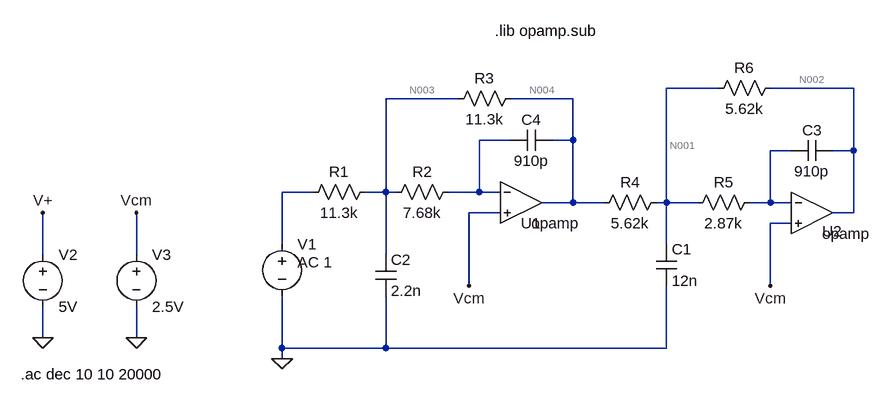
[diagram p0: schematic Anti-Aliasing Filter.asc]
Anti-Aliasing Filter.asc, the LTspice schematic file:
Version 4
SHEET 1 1240 680
WIRE 576 64 496 64
WIRE 784 64 656 64
WIRE 176 80 64 80
WIRE 352 80 256 80
WIRE 256 144 208 144
WIRE 352 144 352 80
WIRE 352 144 320 144
WIRE 688 160 656 160
WIRE 784 160 784 64
WIRE 784 160 752 160
WIRE -48 224 -96 224
WIRE 64 224 64 80
WIRE 64 224 32 224
WIRE 80 224 64 224
WIRE 208 224 208 144
WIRE 208 224 160 224
WIRE 240 224 208 224
WIRE 352 240 352 144
WIRE 352 240 304 240
WIRE 400 240 352 240
WIRE 496 240 496 64
WIRE 496 240 480 240
WIRE 544 240 496 240
WIRE 656 240 656 160
WIRE 656 240 624 240
WIRE 688 240 656 240
WIRE 240 256 192 256
WIRE 784 256 784 160
WIRE 784 256 752 256
WIRE 688 272 656 272
WIRE -96 304 -96 224
WIRE 496 304 496 240
WIRE -464 320 -464 256
WIRE -320 320 -320 256
WIRE 64 320 64 224
WIRE 192 368 192 256
WIRE 656 368 656 272
WIRE -464 448 -464 400
WIRE -320 448 -320 400
WIRE -96 464 -96 384
WIRE 64 464 64 384
WIRE 64 464 -96 464
WIRE 496 464 496 368
WIRE 496 464 64 464
WIRE -96 480 -96 464
FLAG -96 480 0
FLAG -464 448 0
FLAG -320 448 0
FLAG -464 256 V+
FLAG -320 256 Vcm
FLAG 192 368 Vcm
FLAG 656 368 Vcm
SYMBOL Opamps\\opamp 272 176 R0
WINDOW 0 0 96 Left 2
SYMATTR InstName U1
SYMBOL Opamps\\opamp 720 192 R0
WINDOW 0 16 92 Left 2
SYMATTR InstName U2
SYMBOL res 48 208 R90
WINDOW 0 0 56 VBottom 2
WINDOW 3 32 56 VTop 2
SYMATTR InstName R1
SYMATTR Value 11.3k
SYMBOL res 176 208 R90
WINDOW 0 0 56 VBottom 2
WINDOW 3 32 56 VTop 2
SYMATTR InstName R2
SYMATTR Value 7.68k
SYMBOL res 272 64 R90
WINDOW 0 0 56 VBottom 2
WINDOW 3 32 56 VTop 2
SYMATTR InstName R3
SYMATTR Value 11.3k
SYMBOL res 496 224 R90
WINDOW 0 0 56 VBottom 2
WINDOW 3 32 56 VTop 2
SYMATTR InstName R4
SYMATTR Value 5.62k
SYMBOL res 640 224 R90
WINDOW 0 0 56 VBottom 2
WINDOW 3 32 56 VTop 2
SYMATTR InstName R5
SYMATTR Value 2.87k
SYMBOL res 672 48 R90
WINDOW 0 0 56 VBottom 2
WINDOW 3 32 56 VTop 2
SYMATTR InstName R6
SYMATTR Value 5.62k
SYMBOL cap 480 304 R0
SYMATTR InstName C1
SYMATTR Value 12n
SYMBOL cap 48 320 R0
SYMATTR InstName C2
SYMATTR Value 2.2n
SYMBOL cap 752 144 R90
WINDOW 0 0 32 VBottom 2
WINDOW 3 32 32 VTop 2
SYMATTR InstName C3
SYMATTR Value 910p
SYMBOL cap 320 128 R90
WINDOW 0 0 32 VBottom 2
WINDOW 3 32 32 VTop 2
SYMATTR InstName C4
SYMATTR Value 910p
SYMBOL voltage -96 288 R0
WINDOW 3 24 44 Left 2
WINDOW 123 0 0 Left 2
WINDOW 39 0 0 Left 2
SYMATTR InstName V1
SYMATTR Value AC 1
SYMBOL voltage -464 304 R0
WINDOW 123 0 0 Left 2
WINDOW 39 0 0 Left 2
SYMATTR InstName V2
SYMATTR Value 5V
SYMBOL voltage -320 304 R0
WINDOW 123 0 0 Left 2
WINDOW 39 0 0 Left 2
SYMATTR InstName V3
SYMATTR Value 2.5V
TEXT -498 504 Left 2 !.ac dec 10 10 20000
TEXT 232 -24 Left 2 !.lib opamp.sub

The netlist it stands for:
* Anti-Aliasing Filter.asc
XU1 N005 Vcm N004 opamp Aol=100K GBW=10Meg  ; pins invin noninvin out
XU2 N006 Vcm N002 opamp Aol=100K GBW=10Meg  ; pins invin noninvin out
R1 N003 N007 11.3k
R2 N005 N003 7.68k
R3 N004 N003 11.3k
R4 N001 N004 5.62k
R5 N006 N001 2.87k
R6 N002 N001 5.62k
C1 N001 0 12n
C2 N003 0 2.2n
C3 N002 N006 910p
C4 N004 N005 910p
V1 N007 0 AC 1
V2 V+ 0 5V
V3 Vcm 0 2.5V
.ac dec 10 10 20000
.lib opamp.sub
.backanno
.end

* Results of the author's LTspice run, read from the files saved beside the schematic
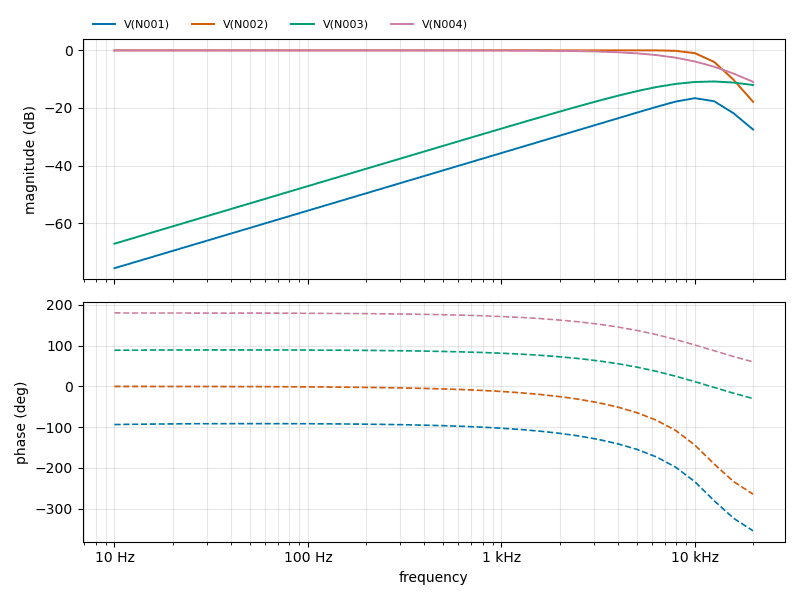
[diagram p1: AC Analysis of Anti-Aliasing Filter.asc, plotted from the saved traces]
* AC Analysis, 1 run:
*   V(N001): -75.63 dB at 10 Hz, -27.47 dB at 20 kHz, peak -16.60 dB at 10 kHz, 3 dB below the peak at 6.346 kHz and 14.02 kHz
*   V(N002): -0.00 dB at 10 Hz, -17.85 dB at 20 kHz, peak 0.01 dB at 5.012 kHz, 3 dB below the peak at 11.66 kHz
*   V(N003): -67.13 dB at 10 Hz, -12.03 dB at 20 kHz, peak -10.81 dB at 12.59 kHz, 3 dB below the peak at 5.304 kHz
*   V(N004): -0.00 dB at 10 Hz, -10.92 dB at 20 kHz, peak -0.00 dB at 10 Hz, 3 dB below the peak at 8.644 kHz